# EAGLE design EEZ DIB v1.0 backplane dimensions (EAGLE 7.2.0)
Assembly variants: Farnell, TME
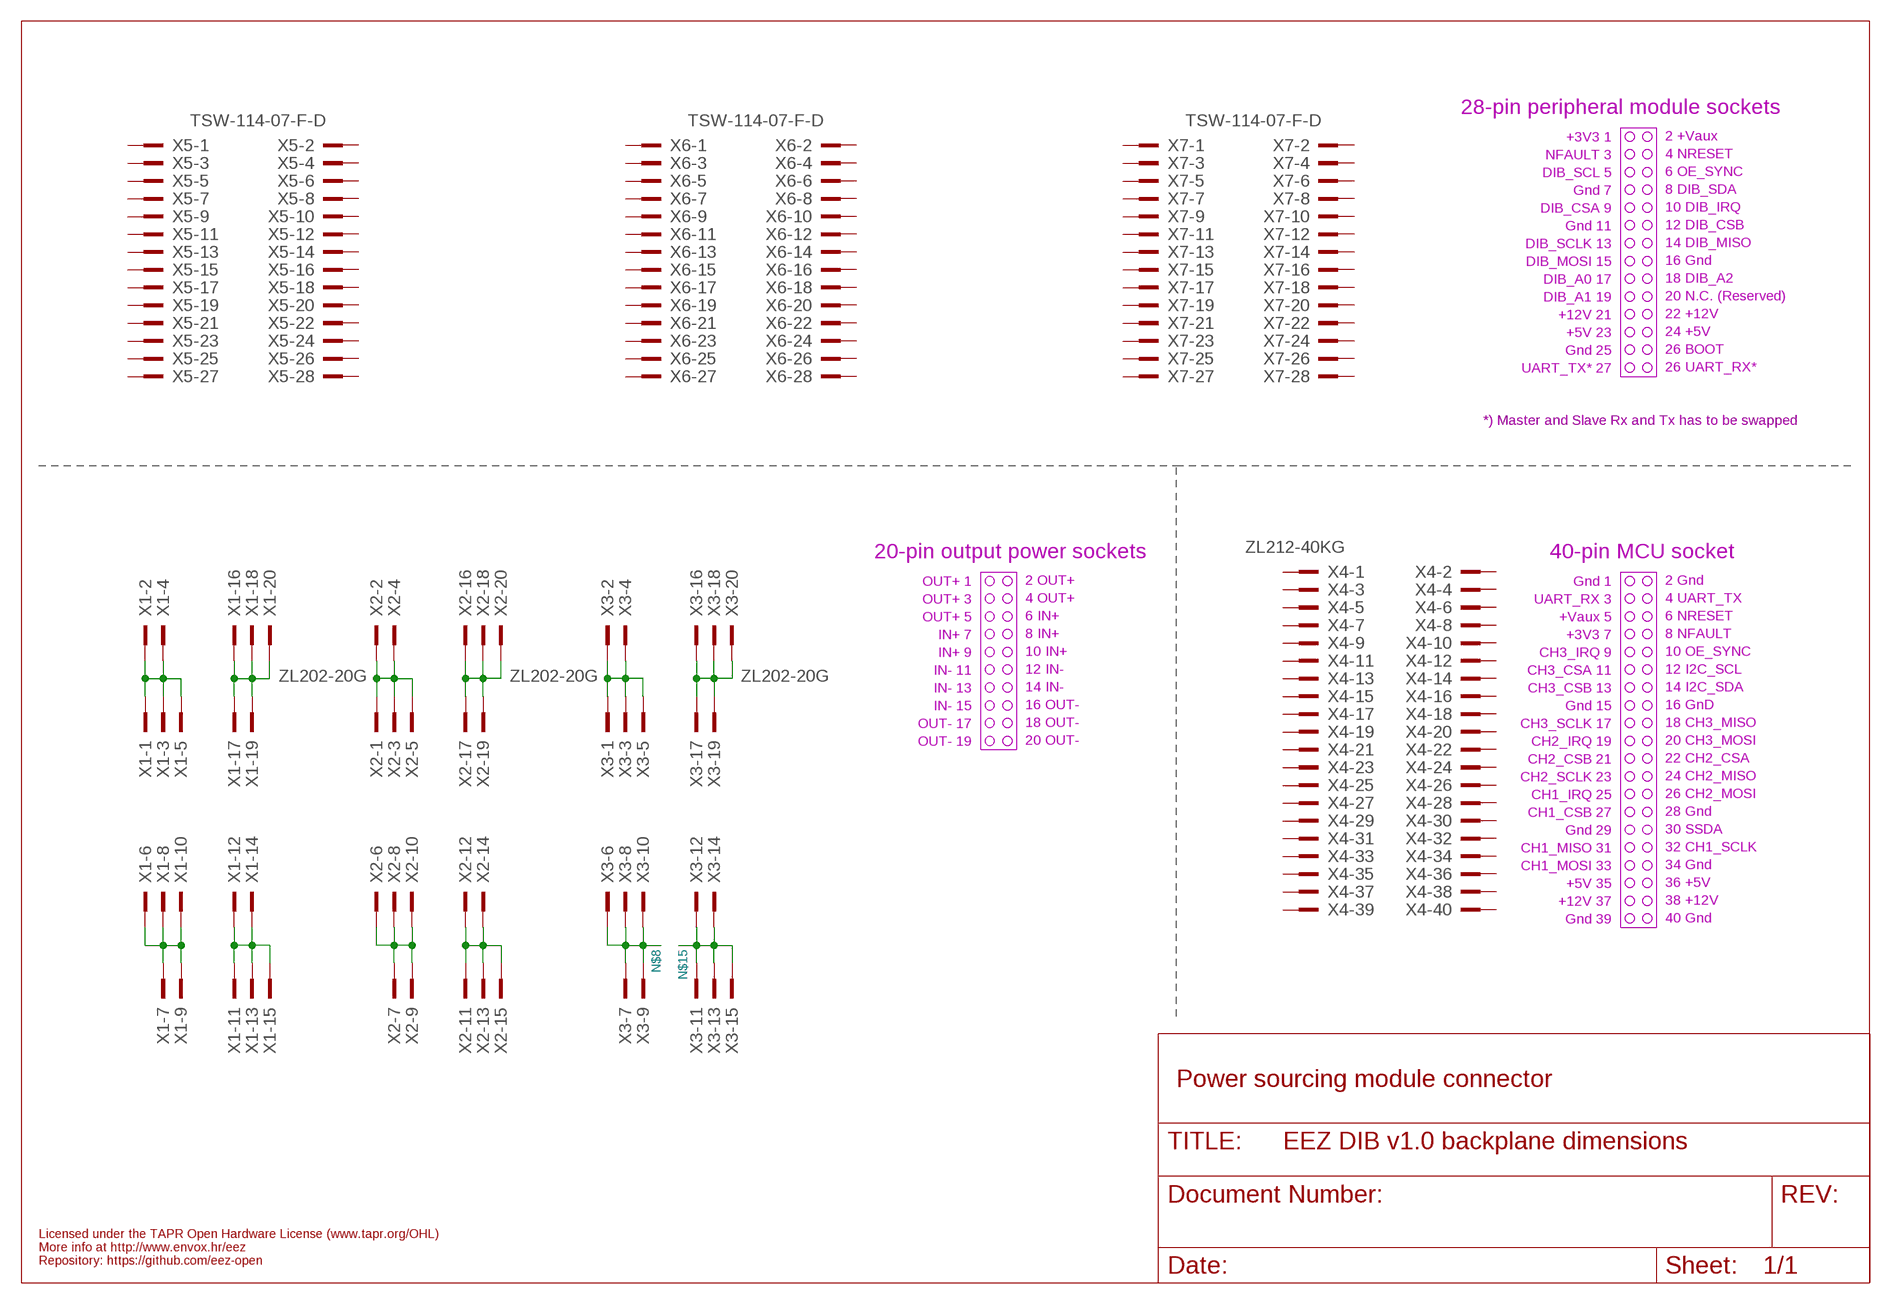
[diagram p0: schematic, sheet 1]

## Parts
X1  ZL202-20G  DS1021-210SF11  [DS1021-2*10SF11]
X2  ZL202-20G  DS1021-210SF11  [DS1021-2*10SF11]
X3  ZL202-20G  DS1021-210SF11  [DS1021-2*10SF11]
X4  ZL212-40KG  [ZL212-40KG]
X5  TSW-114-07-F-D  [TSW-114-07-F-D]
X6  TSW-114-07-F-D  [TSW-114-07-F-D]
X7  TSW-114-07-F-D  [TSW-114-07-F-D]

## Nets
CH1_IN+: X1.6 X1.7 X1.8 X1.9 X1.10
CH1_OUT+: X1.1 X1.2 X1.3 X1.4 X1.5
CH2_OUT+: X2.1 X2.2 X2.3 X2.4 X2.5
CH3+: X3.1 X3.2 X3.3 X3.4 X3.5
CH3-: X3.16 X3.17 X3.18 X3.19 X3.20
N$7: X2.16 X2.17 X2.18 X2.19 X2.20
N$8: X3.6 X3.7 X3.8 X3.9 X3.10
N$15: X3.11 X3.12 X3.13 X3.14 X3.15
N$19: X1.16 X1.17 X1.18 X1.19 X1.20
N$20: X1.11 X1.12 X1.13 X1.14 X1.15
N$22: X2.11 X2.12 X2.13 X2.14 X2.15
N$23: X2.6 X2.7 X2.8 X2.9 X2.10
Unconnected: X4.1 X4.2 X4.3 X4.4 X4.5 X4.6 X4.7 X4.8 X4.9 X4.10 X4.11 X4.12 X4.13 X4.14 X4.15 X4.16 X4.17 X4.18 X4.19 X4.20 X4.21 X4.22 X4.23 X4.24 X4.25 X4.26 X4.27 X4.28 X4.29 X4.30 X4.31 X4.32 X4.33 X4.34 X4.35 X4.36 X4.37 X4.38 X4.39 X4.40 X5.1 X5.2 X5.3 X5.4 X5.5 X5.6 X5.7 X5.8 X5.9 X5.10 X5.11 X5.12 X5.13 X5.14 X5.15 X5.16 X5.17 X5.18 X5.19 X5.20 X5.21 X5.22 X5.23 X5.24 X5.25 X5.26 X5.27 X5.28 X6.1 X6.2 X6.3 X6.4 X6.5 X6.6 X6.7 X6.8 X6.9 X6.10 X6.11 X6.12 X6.13 X6.14 X6.15 X6.16 X6.17 X6.18 X6.19 X6.20 X6.21 X6.22 X6.23 X6.24 X6.25 X6.26 X6.27 X6.28 X7.1 X7.2 X7.3 X7.4 X7.5 X7.6 X7.7 X7.8 X7.9 X7.10 X7.11 X7.12 X7.13 X7.14 X7.15 X7.16 X7.17 X7.18 X7.19 X7.20 X7.21 X7.22 X7.23 X7.24 X7.25 X7.26 X7.27 X7.28

## Notes on the sheet
- 28-pin peripheral module sockets
- +3V3 1
- 2 +Vaux
- NFAULT 3
- 4 NRESET
- DIB_SCL 5
- 6 OE_SYNC
- Gnd 7
- 8 DIB_SDA
- DIB_CSA 9
- 10 DIB_IRQ
- Gnd 11
- 12 DIB_CSB
- DIB_SCLK 13
- 14 DIB_MISO
- DIB_MOSI 15
- 16 Gnd
- DIB_A0 17
- 18 DIB_A2
- DIB_A1 19
- 20 N.C. (Reserved)
- +12V 21
- 22 +12V
- +5V 23
- 24 +5V
- Gnd 25
- 26 BOOT
- UART_TX* 27
- 26 UART_RX*
- *) Master and Slave Rx and Tx has to be swapped
- 20-pin output power sockets | 40-pin MCU socket
- OUT+ 1 | Gnd 1
- 2 OUT+ | 2 Gnd
- OUT+ 3 | UART_RX 3
- 4 OUT+ | 4 UART_TX
- OUT+ 5 | +Vaux 5
- 6 IN+ | 6 NRESET
- IN+ 7 | +3V3 7
- 8 IN+ | 8 NFAULT
- IN+ 9 | CH3_IRQ 9
- 10 IN+ | 10 OE_SYNC
- IN- 11 | CH3_CSA 11
- 12 IN- | 12 I2C_SCL
- IN- 13 | CH3_CSB 13
- 14 IN- | 14 I2C_SDA
- IN- 15 | Gnd 15
- 16 OUT- | 16 GnD
- OUT- 17 | CH3_SCLK 17
- 18 OUT- | 18 CH3_MISO
- OUT- 19 | CH2_IRQ 19
- 20 OUT- | 20 CH3_MOSI
- CH2_CSB 21
- 22 CH2_CSA
- CH2_SCLK 23
- 24 CH2_MISO
- CH1_IRQ 25
- 26 CH2_MOSI
- CH1_CSB 27
- 28 Gnd
- Gnd 29
- 30 SSDA
- CH1_MISO 31
- 32 CH1_SCLK
- CH1_MOSI 33
- 34 Gnd
- +5V 35
- 36 +5V
- +12V 37
- 38 +12V
- Gnd 39
- 40 Gnd
- Power sourcing module connector
- Licensed under the TAPR Open Hardware License (www.tapr.org/OHL)
- More info at http://www.envox.hr/eez
- Repository: https://github.com/eez-open

## Library data of the parts
X1-X3 = EEZ_connectors:DS1021-2*10SF11: Pin header; pin strips; male; PIN:20; straight; 2.54mm; THT; 2x10; FARNELL: 2025179
X4 = EEZ_connectors:ZL212-40KG
X5-X7 = EEZ_connectors:TSW-114-07-F-D: Samtec TSW Header, 2.54MM, THT, 28-way

## Net classes
0 default: width 0.152 mm, drill 0.3 mm, clearance 0.152 mm
1 diff: width 0.152 mm, drill 0.3 mm, clearance 0.152 mm
2 gnd: width 0.152 mm, drill 0.3 mm, clearance 0.152 mm

## Board
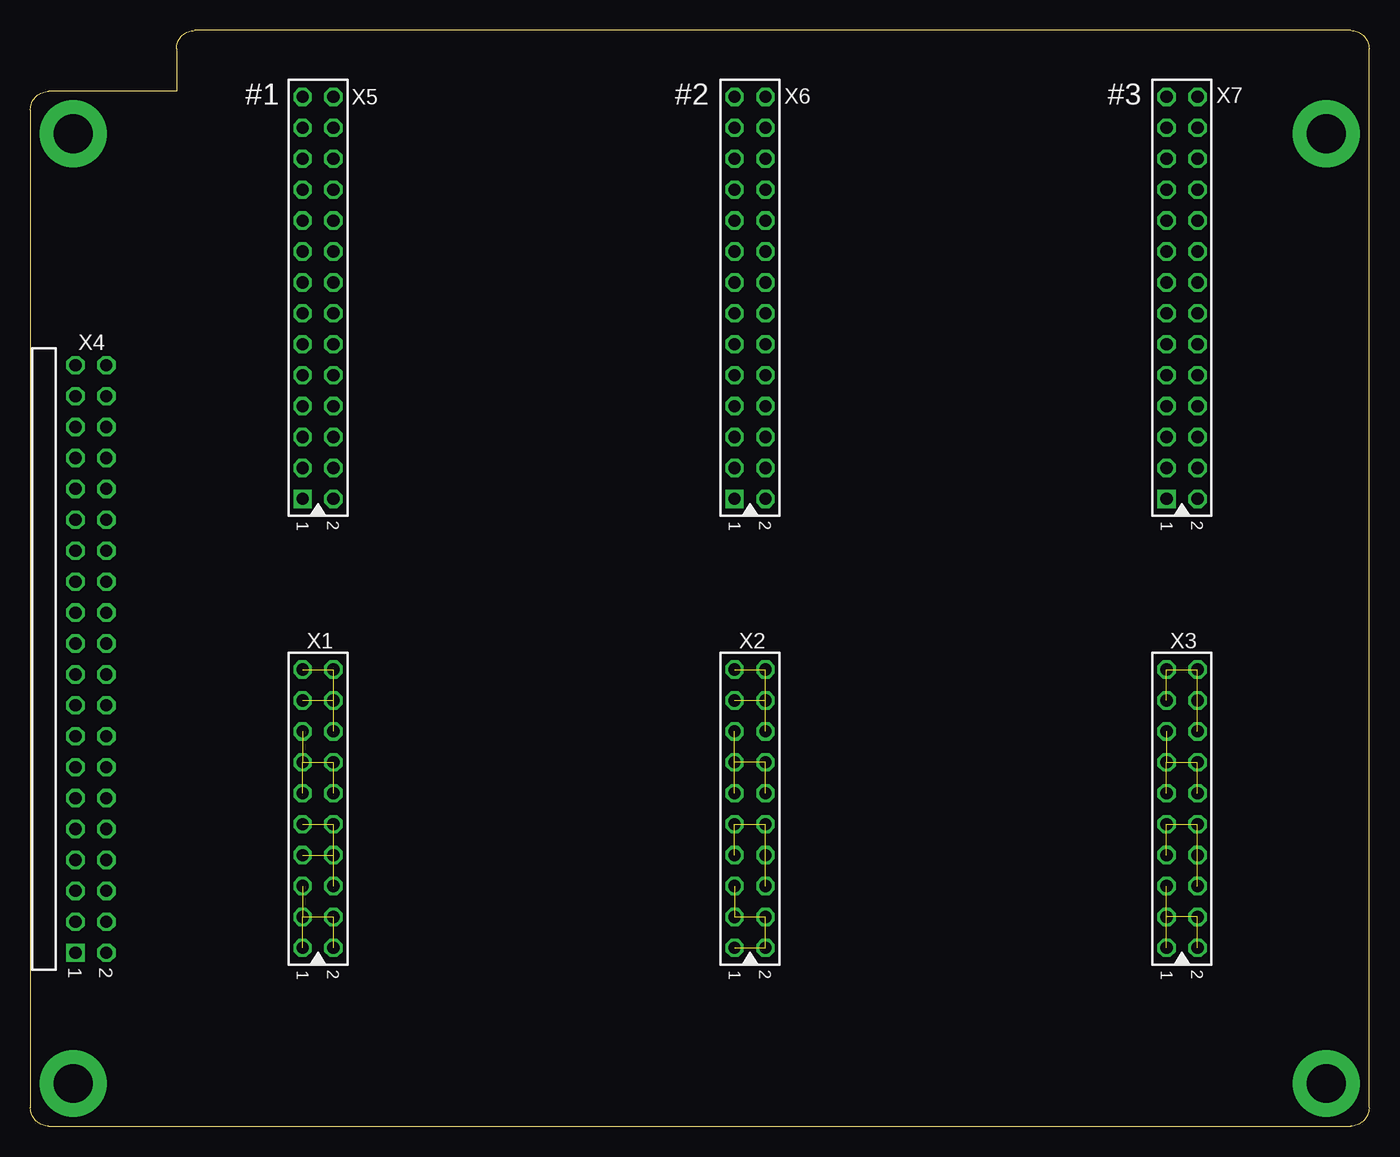
[diagram p1: board, top side]

Size 110 x 90 mm. Coordinates in mm from the lower left corner, seen from the top.
Outline: 1.5,0 108.5,0 arc90 110,1.5 110,88.5 arc90 108.5,90 13.5,90 arc90 12,88.5 12,85 1.5,85 arc90 0,83.5 0,1.5 arc90 1.5,0
Copper layers (1*16): Top 0.035mm / dielectric 1.5mm / Bottom 0.035mm
Design rules "default *": minimum track width 6mil, minimum drill 0.3mm, track to track 4mil, track to pad 4mil, pad to pad 4mil, via to via 4mil, smd to smd 4mil, copper to edge 30mil, drill to drill 8mil, minimum pad ring 4mil, minimum via ring 8mil, stop-mask expansion 2.5mil, vias tented up to drill 0.6mm, thermal gap 8mil

### Footprints (pad centres in the part's own frame; a part is rotated, then mirrored left to right if it is on the bottom)
DS1021-2*10SF11 = drill 1 pad 1.5 octagon: 1 22.86,0; 2 22.86,2.54; 3 20.32,0; 4 20.32,2.54; 5 17.78,0; 6 17.78,2.54; 7 15.24,0; 8 15.24,2.54; 9 12.7,0; 10 12.7,2.54; 11 10.16,0; 12 10.16,2.54; 13 7.62,0; 14 7.62,2.54; 15 5.08,0; 16 5.08,2.54; 17 2.54,0; 18 2.54,2.54; 19 0,0; 20 0,2.54
ZL212-40KG = drill 1 pad 1.5 square: 1 48.26,0 | drill 1 pad 1.5 octagon: 2 48.26,2.54; 3 45.72,0; 4 45.72,2.54; 5 43.18,0; 6 43.18,2.54; 7 40.64,0; 8 40.64,2.54; 9 38.1,0; 10 38.1,2.54; 11 35.56,0; 12 35.56,2.54; 13 33.02,0; 14 33.02,2.54; 15 30.48,0; 16 30.48,2.54; 17 27.94,0; 18 27.94,2.54; 19 25.4,0; 20 25.4,2.54; 21 22.86,0; 22 22.86,2.54; 23 20.32,0; 24 20.32,2.54; 25 17.78,0; 26 17.78,2.54; 27 15.24,0; 28 15.24,2.54; 29 12.7,0; 30 12.7,2.54; 31 10.16,0; 32 10.16,2.54; 33 7.62,0; 34 7.62,2.54; 35 5.08,0; 36 5.08,2.54; 37 2.54,0; 38 2.54,2.54; 39 0,0; 40 0,2.54
TSW-114-07-F-D = drill 1 pad 1.5 square: 1 33.02,0 | drill 1 pad 1.5 octagon: 2 33.02,2.54; 3 30.48,0; 4 30.48,2.54; 5 27.94,0; 6 27.94,2.54; 7 25.4,0; 8 25.4,2.54; 9 22.86,0; 10 22.86,2.54; 11 20.32,0; 12 20.32,2.54; 13 17.78,0; 14 17.78,2.54; 15 15.24,0; 16 15.24,2.54; 17 12.7,0; 18 12.7,2.54; 19 10.16,0; 20 10.16,2.54; 21 7.62,0; 22 7.62,2.54; 23 5.08,0; 24 5.08,2.54; 25 2.54,0; 26 2.54,2.54; 27 0,0; 28 0,2.54

### Placement (x,y rotation side)
X1  22.36,37.5 270 top
X2  57.86,37.5 270 top
X3  93.36,37.5 270 top
X4  3.7,62.5 270 top
X5  22.36,84.54 270 top
X6  57.86,84.54 270 top
X7  93.36,84.54 270 top

### Tracks (layer width: path | path; a pad name or v marks a point on that pad's centre or on a via)
CH1_IN+  (4 unrouted)
CH1_OUT+  (4 unrouted)
CH2_OUT+  (4 unrouted)
CH3+  (4 unrouted)
CH3-  (4 unrouted)
HOLE_MCU1  (via drill 3.2 pad 5.5)
  other vias: 106.5,81.5
HOLE_MCU2  (via drill 3.2 pad 5.5)
  other vias: 3.5,81.5
HOLE_MCU3  (via drill 3.2 pad 5.5)
  other vias: 3.5,3.5
HOLE_MCU4  (via drill 3.2 pad 5.5)
  other vias: 106.5,3.5
N$7  (4 unrouted)
N$8  (4 unrouted)
N$15  (4 unrouted)
N$19  (4 unrouted)
N$20  (4 unrouted)
N$22  (4 unrouted)
N$23  (4 unrouted)

### Text on the board
tPlace: #1 | #2 | #3